# Altium schematic sheet HV Fuses.SchDoc
size A4
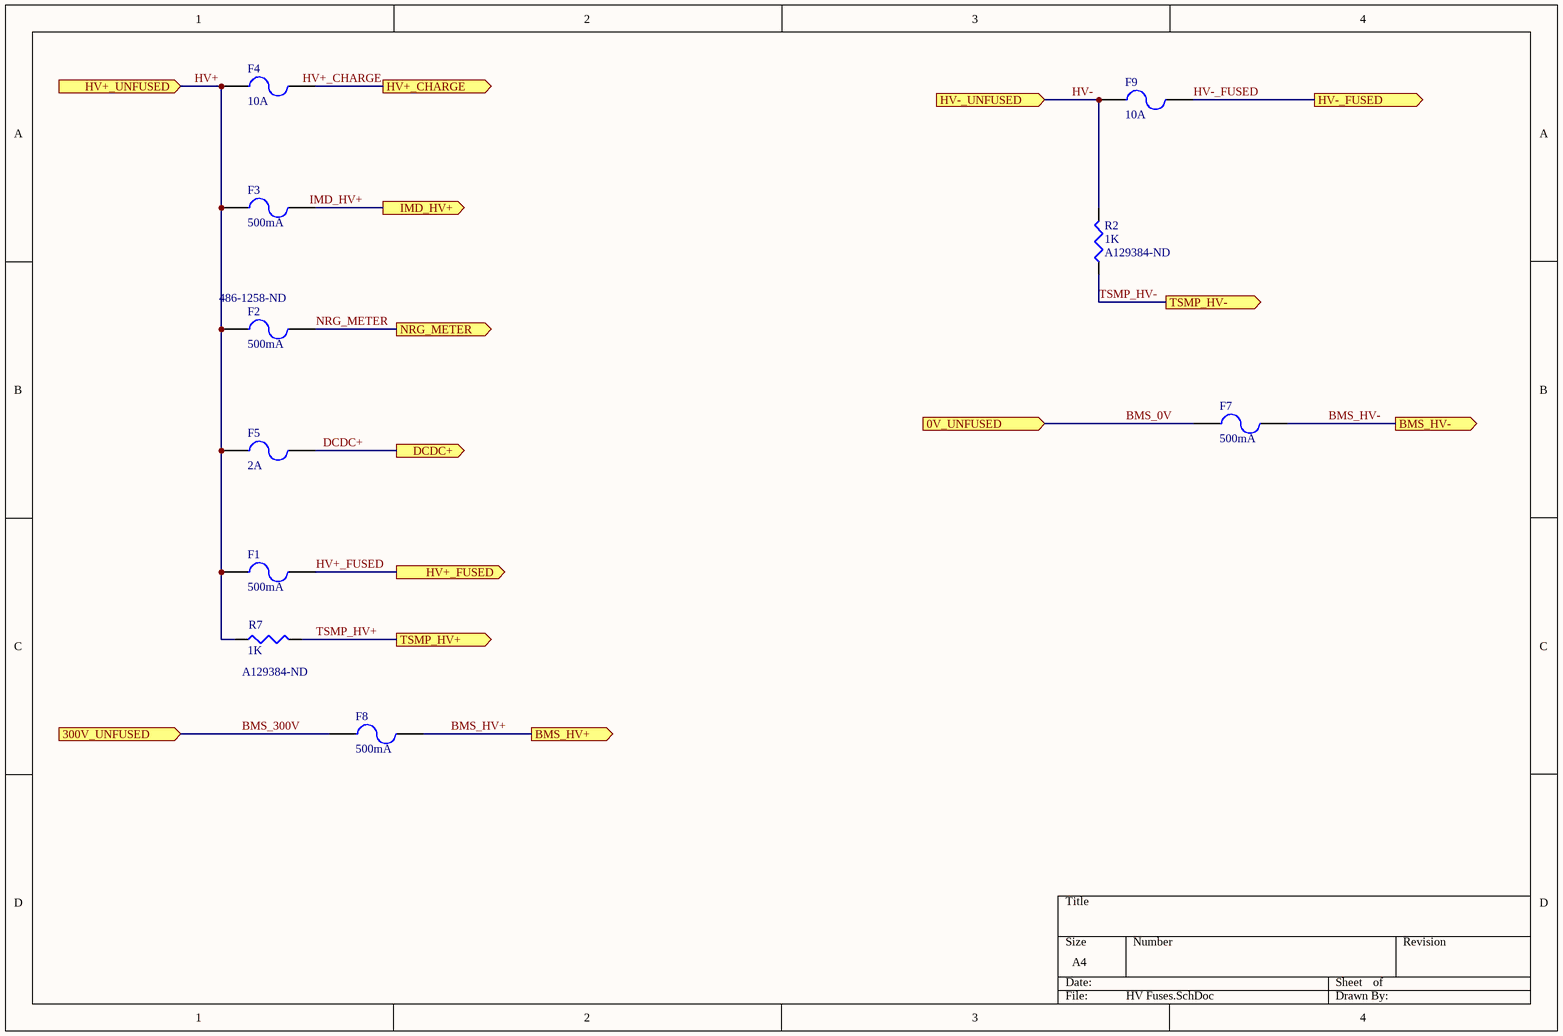
[diagram p0: HV Fuses.SchDoc]

## Parts
F1  500mA  [FUSEHOLDER 5X20]
F2  500mA  Supplier Part Number 1: 486-1258-ND  [FUSEHOLDER 5X20]
F3  500mA  [FUSEHOLDER 5X20]
F4  10A  [FUSEHOLDER 5X20]
F5  2A  [FUSEHOLDER 5X20]
F7  500mA  [FUSEHOLDER 5X20]
F8  500mA  [FUSEHOLDER 5X20]
F9  10A  [FUSEHOLDER 5X20]
R2  1K  Supplier Part Number 1: A129384-ND  [AXIAL RESISTOR WW 14W]
R7  1K  Supplier Part Number 1: A129384-ND  [AXIAL RESISTOR WW 14W]

## Ports
0V_UNFUSED (in), 300V_UNFUSED (in), BMS_HV+ (out), BMS_HV- (out), DCDC+ (out), HV+_CHARGE (out), HV+_FUSED (out), HV+_UNFUSED (in), HV-_FUSED (out), HV-_UNFUSED (in), IMD_HV+ (out), NRG_METER (out), TSMP_HV+ (out), TSMP_HV- (out)

## Nets
BMS_0V: F7.2 ; port 0V_UNFUSED
BMS_300V: F8.2 ; port 300V_UNFUSED
BMS_HV+: F8.1 ; port BMS_HV+
BMS_HV-: F7.1 ; port BMS_HV-
DCDC+: F5.1 ; port DCDC+
HV+: F1.2 F2.2 F3.2 F4.2 F5.2 R7.1 ; port HV+_UNFUSED
HV+_CHARGE: F4.1 ; port HV+_CHARGE
HV+_FUSED: F1.1 ; port HV+_FUSED
HV-: F9.2 R2.2 ; port HV-_UNFUSED
HV-_FUSED: F9.1 ; port HV-_FUSED
IMD_HV+: F3.1 ; port IMD_HV+
NRG_METER: F2.1 ; port NRG_METER
TSMP_HV+: R7.2 ; port TSMP_HV+
TSMP_HV-: R2.1 ; port TSMP_HV-

## Notes on the sheet
- Labels drawn without touching a wire or pin: HV+_CHARGE, IMD_HV+

## Library data of the parts
F1-F5 F7-F9 = Fuse 2: 0031.8201: FUSE BLOK CARTRIDGE 500V 10A PCB; Published: 8-Jun-2000; LatestRevisionDate: 17-Jul-2002; LatestRevisionNote: Re-released for DXP Platform.; PackageReference: PIN-W2/E2.8; Publisher: Altium Limited; PackageDescription: Thru-Hole; 2 Leads
  F2: Supplier 1: Digi-Key
  F3: Supplier 1: Digi-Key; Supplier Part Number 1: 486-1258-ND
  F4: Supplier Part Number 1: 486-1258-ND; Supplier 1: Digi-Key
  F9: Supplier Part Number 1: *
R2 R7 = Res3: 20J1K0E: RES 1K OHM 10W 5% AXIAL; Published: 8-Jun-2000; LatestRevisionDate: 29-May-2009; LatestRevisionNote: IPC-7351 Footprint Added.; PackageReference: J1-0603; Publisher: Altium Limited; PackageDescription: Chip Resistor; Supplier 1: Digi-Key